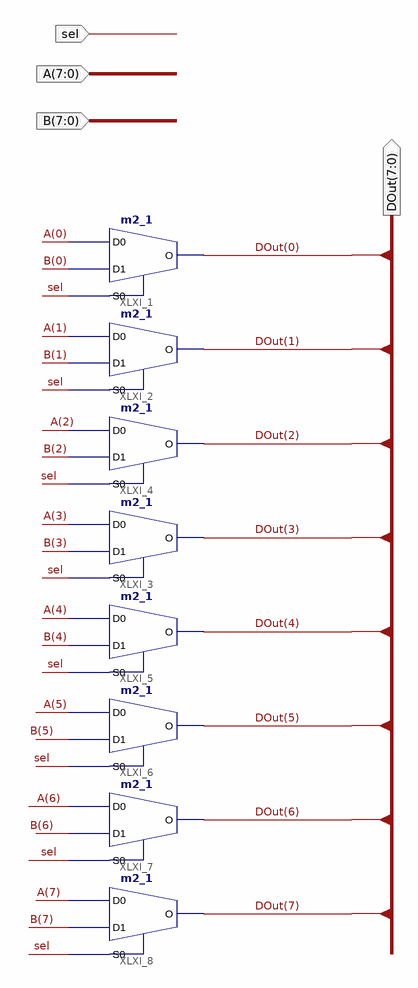
[diagram p0: schematic sheet 1]
// Xilinx ISE schematic mux8x2to1.sch (spartan3e) as structural Verilog: 8 symbols, 4 ports
module mux8x2to1 (
  input  [7:0] A,
  input  [7:0] B,
  input  sel,
  output [7:0] DOut
);

  m2_1 XLXI_1 (.D0(A[0]), .D1(B[0]), .S0(sel), .O(DOut[0]));
  m2_1 XLXI_2 (.D0(A[1]), .D1(B[1]), .S0(sel), .O(DOut[1]));
  m2_1 XLXI_3 (.D0(A[3]), .D1(B[3]), .S0(sel), .O(DOut[3]));
  m2_1 XLXI_4 (.D0(A[2]), .D1(B[2]), .S0(sel), .O(DOut[2]));
  m2_1 XLXI_5 (.D0(A[4]), .D1(B[4]), .S0(sel), .O(DOut[4]));
  m2_1 XLXI_6 (.D0(A[5]), .D1(B[5]), .S0(sel), .O(DOut[5]));
  m2_1 XLXI_7 (.D0(A[6]), .D1(B[6]), .S0(sel), .O(DOut[6]));
  m2_1 XLXI_8 (.D0(A[7]), .D1(B[7]), .S0(sel), .O(DOut[7]));
endmodule
